# EAGLE design neck_assembly (EAGLE 9.0.1)
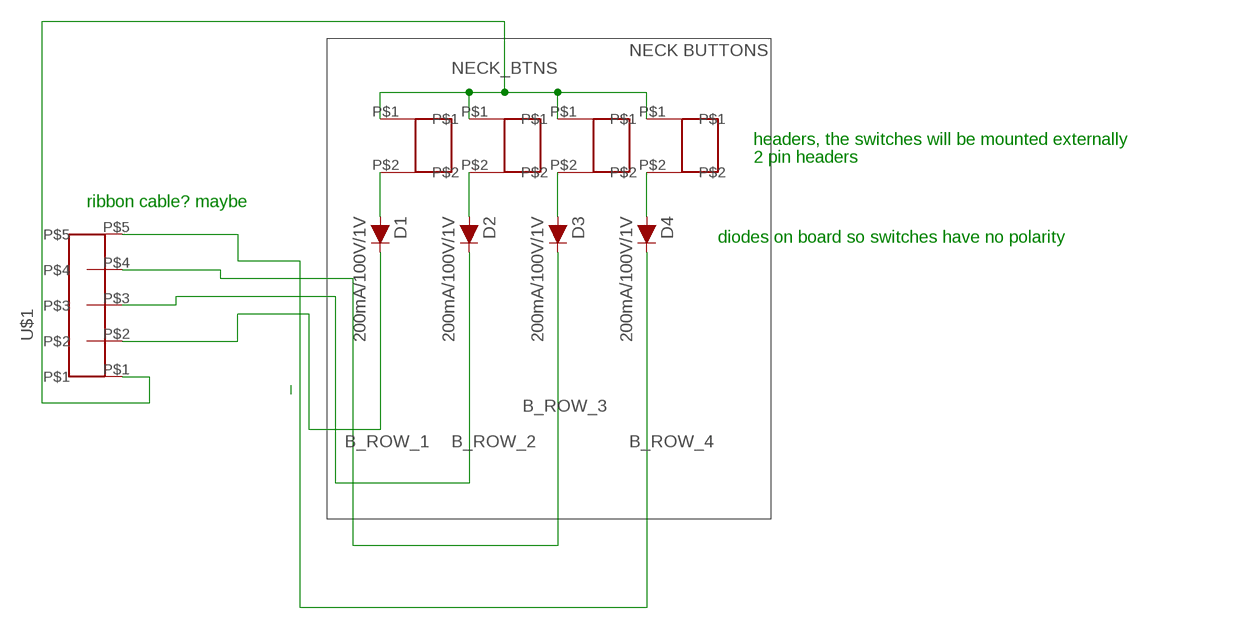
[diagram p0: schematic, sheet 1]

## Parts
B1  2-PIN-HEADER  [2-PIN-HEADER]
B2  2-PIN-HEADER  [2-PIN-HEADER]
B3  2-PIN-HEADER  [2-PIN-HEADER]
B4  2-PIN-HEADER  [2-PIN-HEADER]
D1  200mA/100V/1V  DIODE-1N4148  [DIODE-1N4148]
D2  200mA/100V/1V  DIODE-1N4148  [DIODE-1N4148]
D3  200mA/100V/1V  DIODE-1N4148  [DIODE-1N4148]
D4  200mA/100V/1V  DIODE-1N4148  [DIODE-1N4148]
U$1  5-PIN-HEADER  [5-PIN-HEADER]

## Nets
B_ROW_1: D1.C U$1.P$2
B_ROW_2: D2.C U$1.P$3
B_ROW_3: D3.C U$1.P$4
B_ROW_4: D4.C U$1.P$5
N$13: B1.P$2 D1.A
N$20: B2.P$2 D2.A
N$21: B3.P$2 D3.A
N$23: B4.P$2 D4.A
NECK_BTNS: B1.P$1 B2.P$1 B3.P$1 B4.P$1 U$1.P$1

## Notes on the sheet
- NECK BUTTONS
- headers, the switches will be mounted externally
- 2 pin headers
- ribbon cable? maybe
- diodes on board so switches have no polarity

## Library data of the parts
B1-B4 = mask_lbr:2-PIN-HEADER
D1-D4 = SparkFun-DiscreteSemi:DIODE: Diode These are standard reverse protection diodes and small signal diodes. SparkFun Products: SparkFun SparkPunk Sound Kit <https://www.sparkfun.com/products/11177> SparkFun ESP8266 Thing <https://www.sparkfun.com/products/13231>; PROD_ID: DIO-08378
U$1 = mask_lbr:5-PIN-HEADER

## Net classes
0 default: width 0.457 mm, drill 0.254 mm, clearance 0.254 mm

## Board
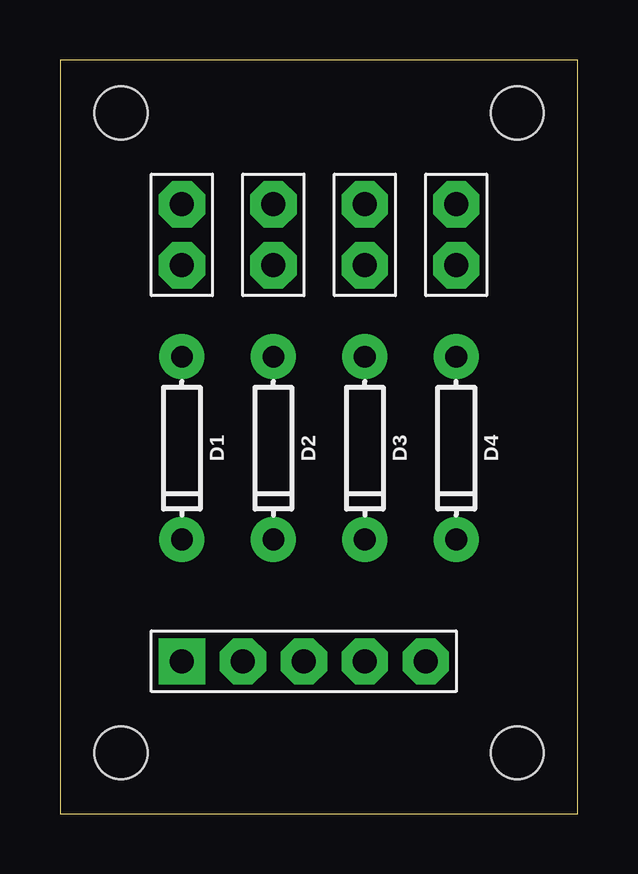
[diagram p1: board, top side]
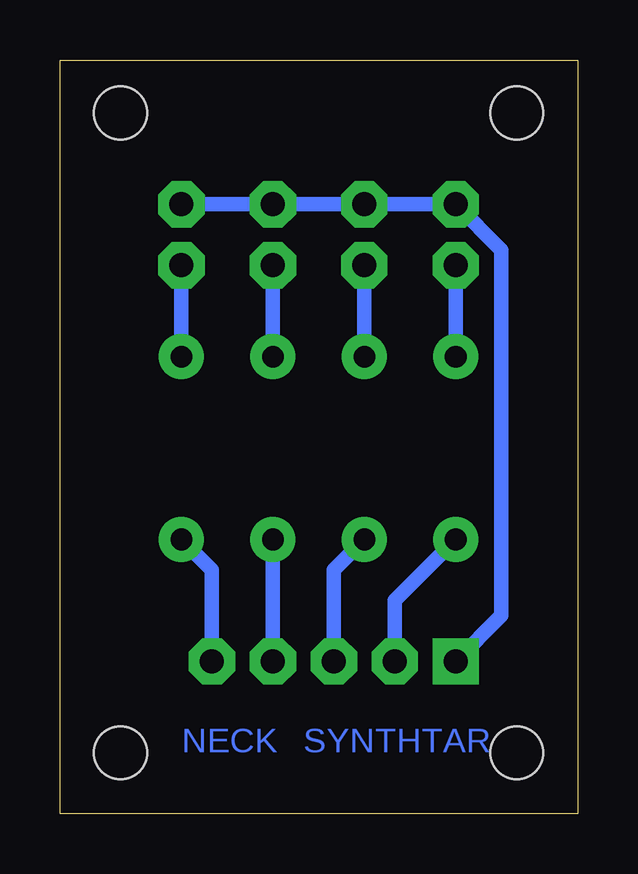
[diagram p2: board, bottom side, seen from below]

Size 21.57 x 31.42 mm. Coordinates in mm from the lower left corner, seen from the top.
Outline: 0,0 21.57,0 21.57,31.42 0,31.42 0,0
Copper layers (1*16): Top 0.035mm / dielectric 1.5mm / Bottom 0.035mm
Design rules "default": minimum track width 6mil, minimum drill 0.35mm, track to track 6mil, track to pad 6mil, pad to pad 6mil, via to via 6mil, smd to smd 6mil, copper to edge 40mil, drill to drill 6mil, minimum pad ring 10mil, minimum via ring 8mil, stop-mask expansion 4mil, vias tented up to drill 0mil, thermal gap 10mil
Holes 2.2 mm at 2.54,2.54 19.05,2.54 19.05,29.21 2.54,29.21

### Footprints (pad centres in the part's own frame; a part is rotated, then mirrored left to right if it is on the bottom)
2-PIN-HEADER = drill 1 pad 1.93 octagon: P$1 -1.27,0; P$2 1.27,0
DIODE-1N4148 = drill 0.9 pad 1.88: A -3.81,0; C 3.81,0
5-PIN-HEADER = drill 1 pad 1.93 square: P$1 -5.08,0 | drill 1 pad 1.93 octagon: P$2 -2.54,0; P$3 0,0; P$4 2.54,0; P$5 5.08,0

### Placement (x,y rotation side)
B1  5.08,24.13 270 top
B2  8.89,24.13 270 top
B3  12.7,24.13 270 top
B4  16.51,24.13 270 top
D1  5.08,15.24 270 top
D2  8.89,15.24 270 top
D3  12.7,15.24 270 top
D4  16.51,15.24 270 top
U$1  10.16,6.35 0 top

### Tracks (layer width: path | path; a pad name or v marks a point on that pad's centre or on a via)
B_ROW_1
  Bottom 0.61: D1.C 7.62,8.89 U$1.P$2
B_ROW_2
  Bottom 0.61: D2.C 10.16,10.16 U$1.P$3
B_ROW_3
  Bottom 0.61: U$1.P$4 D3.C
B_ROW_4
  Bottom 0.61: D4.C 15.24,10.16 U$1.P$5
N$13
  Bottom 0.61: B1.P$2 D1.A
N$20
  Bottom 0.61: B2.P$2 D2.A
N$21
  Bottom 0.61: B3.P$2 D3.A
N$23
  Bottom 0.61: B4.P$2 D4.A
NECK_BTNS
  Bottom 0.61: U$1.P$1 3.17,8.25 3.17,23.5 B1.P$1 B2.P$1 B3.P$1 B4.P$1

### Text on the board
Bottom: SYNTHTAR | NECK